# EAGLE design Yayın Ders 1 (EAGLE 9.6.2)
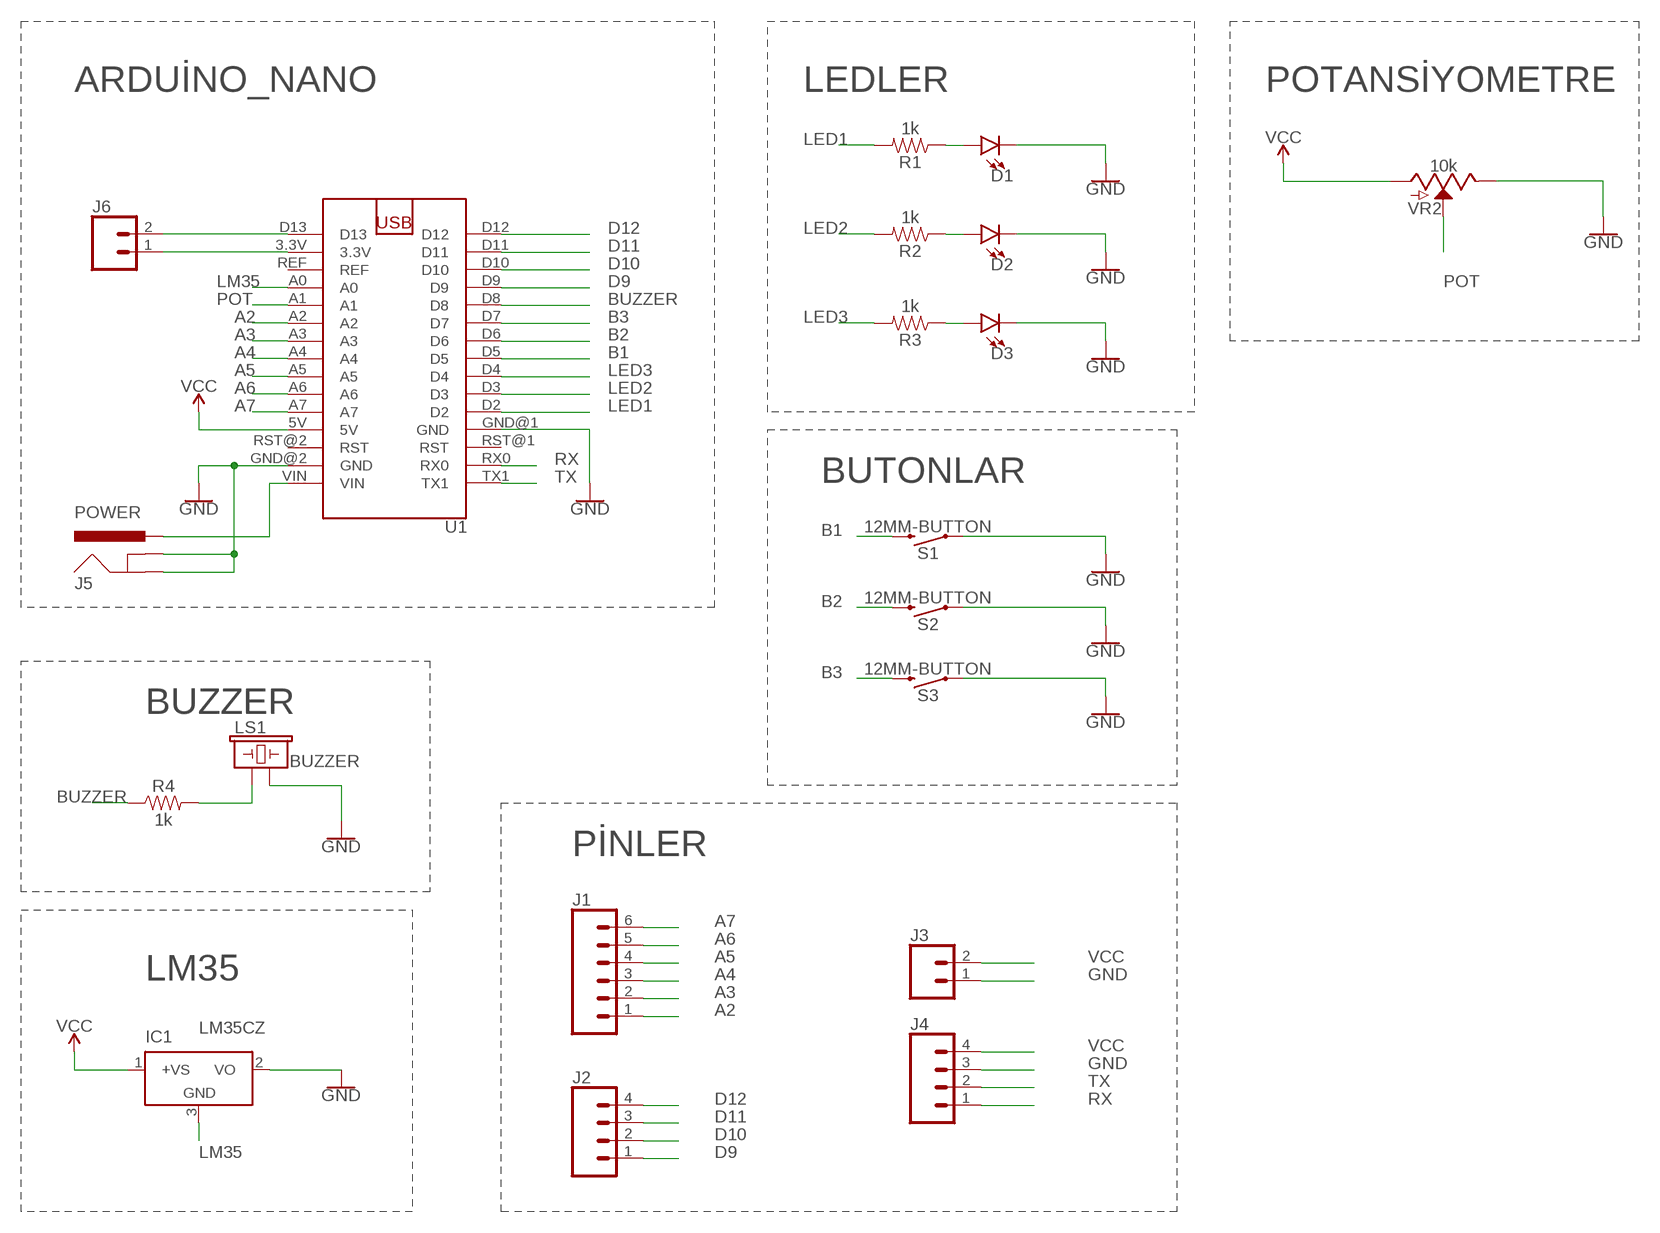
[diagram p0: schematic, sheet 1]

## Parts
D1  LED-3MM-NO_SILK  [LED_3MM-NS]
D2  LED-3MM-NO_SILK  [LED_3MM-NS]
D3  LED-3MM-NO_SILK  [LED_3MM-NS]
IC1  LM35CZ  [TO92]
J1  CONN_06LOCK  [1X06_LOCK]
J2  CONN_04  [1X04]
J3  CONN_02  [1X02]
J4  CONN_04  [1X04]
J5  POWER  POWER_JACK  [POWER_JACK_PTH]
J6  CONN_02  [1X02]
LS1  BUZZER  BUZZER-PTH  [BUZZER-12MM]
R1  1k  1KOHM-HORIZ-1/4W-1%  [AXIAL-0.3]
R2  1k  1KOHM-HORIZ-1/4W-1%  [AXIAL-0.3]
R3  1k  1KOHM-HORIZ-1/4W-1%  [AXIAL-0.3]
R4  1k  1KOHM-HORIZ-1/4W-1%  [AXIAL-0.3]
S1  12MM-BUTTON  MOMENTARY-SWITCH-SPST-PTH-12MM  [TACTILE_SWITCH_PTH_12MM]
S2  12MM-BUTTON  MOMENTARY-SWITCH-SPST-PTH-12MM  [TACTILE_SWITCH_PTH_12MM]
S3  12MM-BUTTON  MOMENTARY-SWITCH-SPST-PTH-12MM  [TACTILE_SWITCH_PTH_12MM]
U1  ARDUINO_NANO  [ARDUINO_NANO]
VR2  10k  POTENTIOMETER-PTH-9MM-1/20W-20%  [POT-PTH-ALPS]

## Nets
A2: J1.1 U1.A2
A3: J1.2 U1.A3
A4: J1.3 U1.A4
A5: J1.4 U1.A5
A6: J1.5 U1.A6
A7: J1.6 U1.A7
B1: S1.3 U1.D5
B2: S2.3 U1.D6
B3: S3.3 U1.D7
BUZZER: R4.P$1 U1.D8
D9: J2.1 U1.D9
D10: J2.2 U1.D10
D11: J2.3 U1.D11
D12: J2.4 U1.D12
GND: D1.K(C) D2.K(C) D3.K(C) IC1.2(VO) J3.1 J4.3 J5.GND J5.GNDBREAK LS1.- S1.1 S2.1 S3.1 U1.GND@1(GND) U1.GND@2(GND) VR2.P$1(E)
LED1: R1.P$2 U1.D2
LED2: R2.P$2 U1.D3
LED3: R3.P$2 U1.D4
LM35: IC1.3(GND) U1.A0
N$1: J5.PWR U1.VIN
N$2: J6.2 U1.D13
N$3: J6.1 U1.3.3V
N$4: LS1.+ R4.P$2
N$12: D1.A R1.P$1
N$13: D2.A R2.P$1
N$14: D3.A R3.P$1
POT: U1.A1 VR2.P$2(S)
RX: J4.1 U1.RX0
TX: J4.2 U1.TX1
VCC: IC1.1(+VS) J3.2 J4.4 U1.5V VR2.P$3(A)
Unconnected: U1.REF U1.RST@1(RST) U1.RST@2(RST)

## Notes on the sheet
- ARDUİNO_NANO | LEDLER | POTANSİYOMETRE
- BUTONLAR
- BUZZER
- PİNLER
- LM35

## Library data of the parts
D1-D3 = SparkFun-LED:LED: LED (Generic) Standard schematic elements and footprints for 5mm, 3mm, 1206, and 0603 sized LEDs. Generic LEDs with no color specified.
IC1 = lm35:LM35: Single-Supply Centigrade Temperature Sensor Vout = (10mV/°C x Temp °C) +5mmmV Source: http://www.national.com/ds/LM/LM35.pdf
J1 = SparkFun-Connectors:CONN_06: Multi connection point. Often used as Generic Header-pin footprint for 0.1 inch spaced/style header connections On any of the 0.1 inch spaced packages, you can populate with these: Break Away Headers - Straight <https://www.sparkfun.com/products/116> (PRT-00116) Break Away Male Headers - Right Angle <https://www.sparkfun.com/products/553> (PRT-00553) Female Headers <https://www.sparkfun.com/products/115> (PRT-00115) Break Away Headers - Machine Pin <https://www.sparkfun.com/products/117> (PRT-00117) Break Away Female Headers - Swiss Machine Pin <https://www.sparkfun.com/products/743> (PRT-00743) Arduino Stackable Header - 6 Pin <https://www.sparkfun.com/products/9280> (PRT-09280) For SCREWTERMINALS and SPRING TERMINALS visit here: Screw Terimnals on SparkFun.com <https://www.sparkfun.com/search/results?term=Screw+Terminals> (5mm/3.5mm/2.54mm spacing) This device is also useful as a general connection point to wire up your design to another part of your project. Our various solder wires solder well into these plated through hole pads. Hook-Up Wire - Assortment (Stranded, 22 AWG) <https://www.sparkfun.com/products/11375> (PRT-11375) Hook-Up Wire - Assortment (Solid Core, 22 AWG) <https://www.sparkfun.com/products/11367> (PRT-11367) View the entire wire category on our website here <https://www.sparkfun.com/categories/141>
J2 J4 = SparkFun-Connectors:CONN_04: Multi connection point. Often used as Generic Header-pin footprint for 0.1 inch spaced/style header connections On any of the 0.1 inch spaced packages, you can populate with these: Break Away Headers - Straight <https://www.sparkfun.com/products/116> (PRT-00116) Break Away Male Headers - Right Angle <https://www.sparkfun.com/products/553> (PRT-00553) Female Headers <https://www.sparkfun.com/products/115> (PRT-00115) Break Away Headers - Machine Pin <https://www.sparkfun.com/products/117> (PRT-00117) Break Away Female Headers - Swiss Machine Pin <https://www.sparkfun.com/products/743> (PRT-00743) For SCREWTERMINALS and SPRING TERMINALS visit here: Screw Terimnals on SparkFun.com <https://www.sparkfun.com/search/results?term=Screw+Terminals> (5mm/3.5mm/2.54mm spacing) This device is also useful as a general connection point to wire up your design to another part of your project. Our various solder wires solder well into these plated through hole pads. Hook-Up Wire - Assortment (Stranded, 22 AWG) <https://www.sparkfun.com/products/11375> (PRT-11375) Hook-Up Wire - Assortment (Solid Core, 22 AWG) <https://www.sparkfun.com/products/11367> (PRT-11367) View the entire wire category on our website here <https://www.sparkfun.com/categories/141> Special notes: Molex polarized connector foot print use with SKU : PRT-08231 with associated crimp pins and housings. 1MM SMD Version SKU: PRT-10208; PROD_ID: CONN-09696
J3 J6 = SparkFun-Connectors:CONN_02: Multi connection point. Often used as Generic Header-pin footprint for 0.1 inch spaced/style header connections On any of the 0.1 inch spaced packages, you can populate with these: Break Away Headers - Straight <https://www.sparkfun.com/products/116> (PRT-00116) Break Away Male Headers - Right Angle <https://www.sparkfun.com/products/553> (PRT-00553) Female Headers <https://www.sparkfun.com/products/115> (PRT-00115) Break Away Headers - Machine Pin <https://www.sparkfun.com/products/117> (PRT-00117) Break Away Female Headers - Swiss Machine Pin <https://www.sparkfun.com/products/743> (PRT-00743) For SCREWTERMINALS and SPRING TERMINALS visit here: Screw Terimnals on SparkFun.com <https://www.sparkfun.com/search/results?term=Screw+Terminals> (5mm/3.5mm/2.54mm spacing) This device is also useful as a general connection point to wire up your design to another part of your project. Our various solder wires solder well into these plated through hole pads. Hook-Up Wire - Assortment (Stranded, 22 AWG) <https://www.sparkfun.com/products/11375> (PRT-11375) Hook-Up Wire - Assortment (Solid Core, 22 AWG) <https://www.sparkfun.com/products/11367> (PRT-11367) View the entire wire category on our website here <https://www.sparkfun.com/categories/141> Special notes: Molex polarized connector foot print use with: PRT-08233 with associated crimp pins and housings. 2.54_SCREWTERM for use with PRT-10571. 3.5mm Screw Terminal footprints for PRT-08084 5mm Screw Terminal footprints for use with PRT-08432
J5 = SparkFun-Connectors:POWER_JACK: Power Jack Connector This is the standard 5.5mm barrel jack for power. The PTH is the most common, proven, reliable, footprint. The Slot footprint only works if the mill layer is transmitted to the PCB fab house so be warned. Here are the connectors we sell at SparkFun: DC Barrel Power Jack/Connector <https://www.sparkfun.com/products/119> (PRT-00119) DC Barrel Power Jack/Connector (SMD) <https://www.sparkfun.com/products/12748> (PRT-12748) DC Barrel Jack Adapter - Breadboard Compatible <https://www.sparkfun.com/products/10811> (PRT-10811) It is used on this SparkFun product (and many, many others): SparkFun RedBoard - Programmed with Arduino <https://www.sparkfun.com/products/12757> (DEV-12757) Also, if you need a mating power supply or connector, please check these out: Wall Adapter Power Supply - 9VDC 650mA <https://www.sparkfun.com/products/298> (TOL-00298) DC Barrel Jack Adapter - Male <https://www.sparkfun.com/products/10287> (PRT-10287); PROD_ID: CONN-08197
LS1 = SparkFun-Electromechanical:BUZZER: Buzzer Small round buzzers that operate around the audible 2kHz range. You can use these as speakers to create simple music or user interfaces. Variant Overview: PTH - Mini Speaker - PC Mount 12mm 2.048kHz <https://www.sparkfun.com/products/7950> PTH_KIT - Mini Speaker - PC Mount 12mm 2.048kHz <https://www.sparkfun.com/products/7950> KIT simplifies soldering by adding stop mask to one side of the pads. PTH_NO_SILK - Mini Speaker - PC Mount 12mm 2.048kHz <https://www.sparkfun.com/products/7950> No silkscreen indicator of buzzer outline. PTH_KIT_NO_SILK - Mini Speaker - PC Mount 12mm 2.048kHz <https://www.sparkfun.com/products/7950> KIT package w/o silkscreen SMD - Buzzer Audio Magnetic (CCV-084B16) SMD buzzer used on, e.g. the LilyPad Buzzer <https://www.sparkfun.com/products/8463> and RFID USB Reader <https://www.sparkfun.com/products/9963>. SMD_KIT - Buzzer Audio Magnetic (CCV-084B16) SMD Buzzer with elongated pins to make soldering easier. Used on the SparkFun Simon Says - Surface Mount Soldering Kit <https://www.sparkfun.com/products/10935>.; PROD_ID: COMP-08253; SF_SKU: COM-07950
R1-R4 = SparkFun-Resistors:1KOHM: 1kΩ resistor A resistor is a passive two-terminal electrical component that implements electrical resistance as a circuit element. Resistors act to reduce current flow, and, at the same time, act to lower voltage levels within circuits. - Wikipedia; PROD_ID: RES-12182
S1-S3 = SparkFun-Switches:MOMENTARY-SWITCH-SPST: Momentary Switch (Pushbutton) - SPST Normally-open (NO) SPST momentary switches (buttons, pushbuttons). Variants PTH-12MM - 12mm square, through-hole Momentary Pushbutton Switch - 12mm Square <https://www.sparkfun.com/products/9190> (COM-09190) PTH-6.0MM, PTH-6.0MM-KIT - 6.0mm square, through-hole Mini Pushbutton Switch <https://www.sparkfun.com/products/97> (COM-00097) KIT package intended for soldering kit's - only one side of pads' copper is exposed. PTH-RIGHT-ANGLE-KIT - Right-angle, through-hole Right Angle Tactile Button <https://www.sparkfun.com/products/10791> - Used on SparkFun BigTime Watch Kit <https://www.sparkfun.com/products/11734> SMD-12MM - 12mm square, surface-mount Tactile Button - SMD (12mm) <https://www.sparkfun.com/products/12993> (COM-12993) Used on SparkFun PicoBoard <https://www.sparkfun.com/products/11888> SMD-4.5MM - 4.5mm Square Trackball Switch Used on SparkFun Blackberry Trackballer Breakout <https://www.sparkfun.com/products/13169> SMD-4.6MMX2.8MM - 4.60mm x 2.80mm, surface mount Used on SparkFun SAMD21 Mini Breakout <https://www.sparkfun.com/products/13664> SMD-5.2MM, SMD-5.2-REDUNDANT - 5.2mm square, surface-mount Mini Pushbutton Switch - SMD <https://www.sparkfun.com/products/8720> (COM-08720) Used on Arduino Pro Mini <https://www.sparkfun.com/products/11114> REDUNDANT package connects both switch circuits together SMD-6.0X3.5MM - 6.0 x 3.5mm, surface mount Momentary Reset Switch SMD <https://www.sparkfun.com/products/8229> (COM-08229) SMD-6.2MM-TALL - 6.2mm square, surface mount Tactile Button - SMD (6mm) <https://www.sparkfun.com/products/12992> Used on SparkFun Digital Sandbox <https://www.sparkfun.com/products/12651> SMD-RIGHT-ANGLE - Right-angle, surface mount Used on SparkFun Block for Intel® Edison - Arduino <https://www.sparkfun.com/products/13036>; PROD_ID: SWCH-09185; SF_SKU: COM-09190
U1 = LezzetliRobotTrifleri:ARDUINO_NANO: ARDUİNO NANO DEVİCE
VR2 = SparkFun-Resistors1:POTENTIOMETER: Potentiometer (Pot) Three-terminal potentiometers, with an adjustable wiper and two adjustable resistors. A pot can be used to create a configurable voltage divider, or as a variable resistor. Variants ALPS_POT and ALPS_POT_KIT - PTH, breadboard compatible, 9mm square pots Rotary Potentiometer - Linear (10k ohm) <https://www.sparkfun.com/products/9288> (COM-09288) The KIT variant exposes copper on only one side of the PTH pad, so the part can only be assembled on one side of the PCB. Useful for beginner soldering kits.; PROD_ID: RES-09177; SF_SKU: COM-09288

## Board
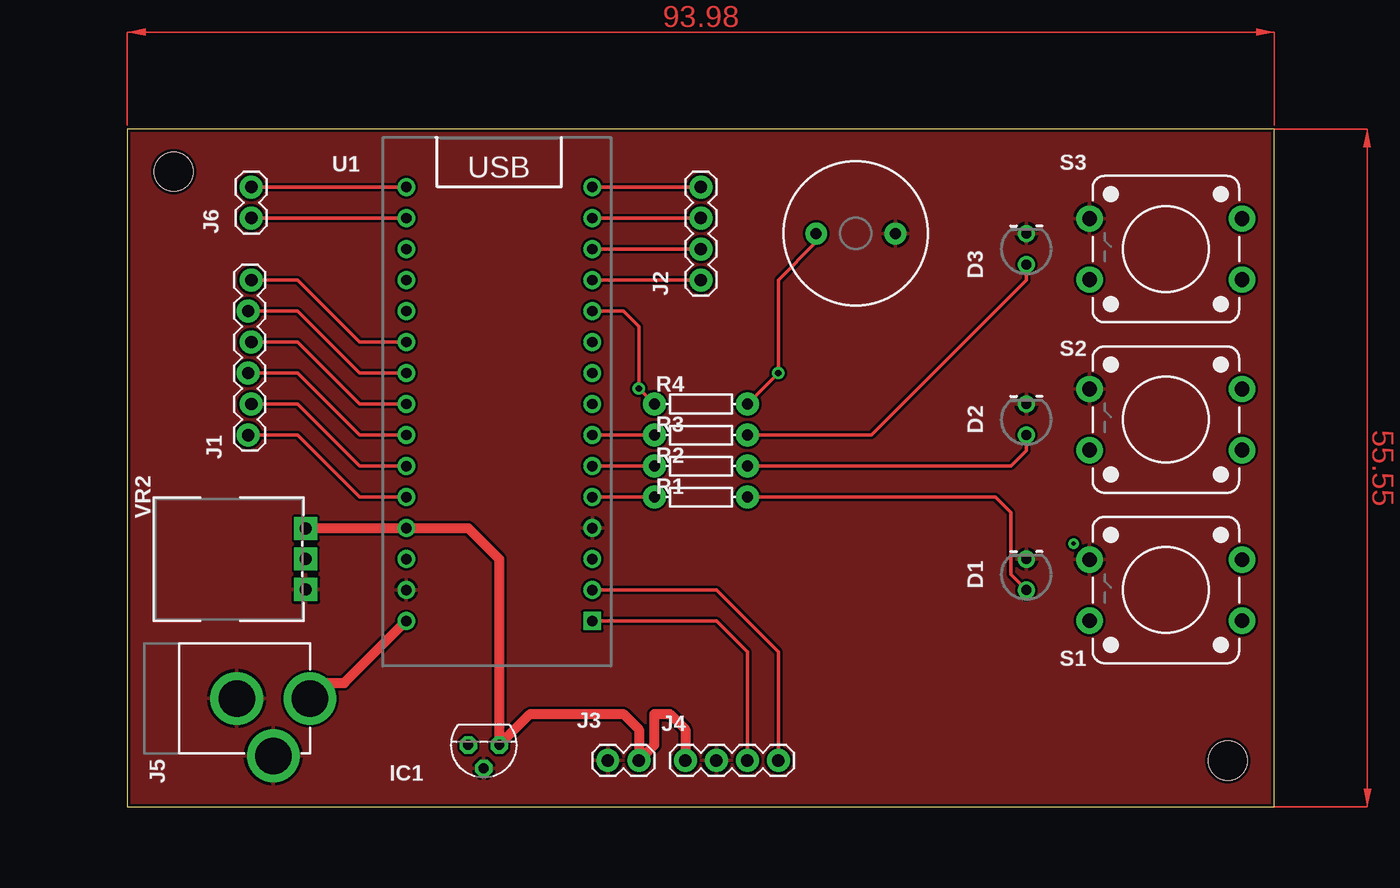
[diagram p1: board, top side]
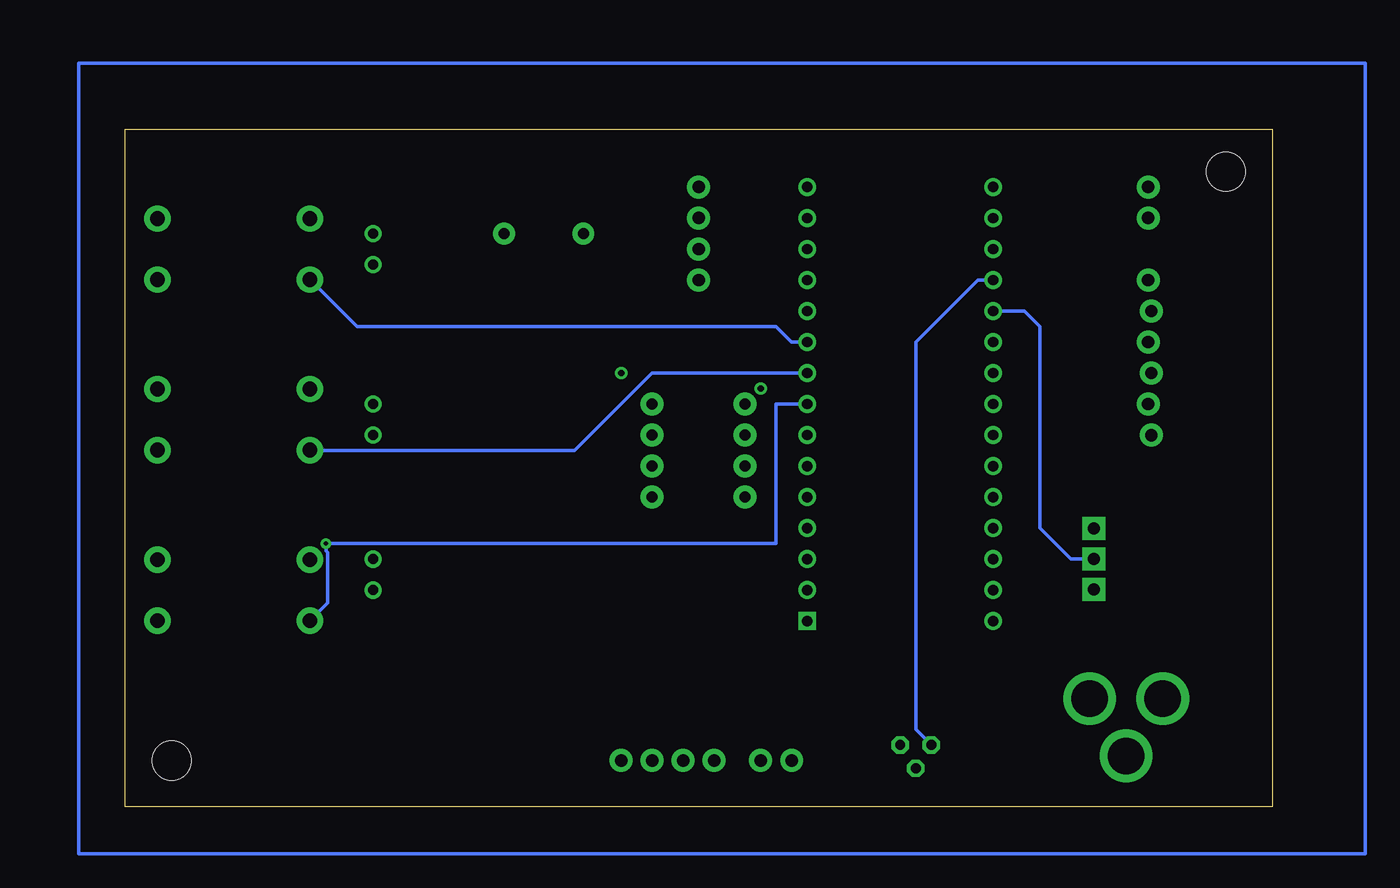
[diagram p2: board, bottom side, seen from below]

Size 93.96 x 55.55 mm. Coordinates in mm from the lower left corner, seen from the top.
Outline: 0,55.55 0,0 93.96,0 93.96,55.55 0,55.55
Copper layers (1*16): Top 0.035mm / dielectric 1.5mm / Bottom 0.035mm
Design rules "SparkFun": minimum track width 8mil, minimum drill 20mil, track to track 8mil, track to pad 8mil, pad to pad 8mil, via to via 8mil, smd to smd 8mil, copper to edge 10mil, drill to drill 8mil, minimum pad ring 12mil, minimum via ring 10mil, stop-mask expansion 4mil, vias tented up to drill 25mil, thermal gap 10mil
Holes 3.2 mm at 3.81,52.07 90.17,3.81

### Footprints (pad centres in the part's own frame; a part is rotated, then mirrored left to right if it is on the bottom)
LED_3MM-NS = drill 0.813: A -1.27,0; K 1.27,0
TO92 = drill 0.813 octagon: 1 -1.27,0; 2 0,1.905; 3 1.27,0
1X06_LOCK = drill 1.016 pad 1.88: 1 0,0; 2 2.54,-0.254; 3 5.08,0; 4 7.62,-0.254; 5 10.16,0; 6 12.7,-0.254
1X04 = drill 1.016 pad 1.88: 1 0,0; 2 2.54,0; 3 5.08,0; 4 7.62,0
1X02 = drill 1.016 pad 1.88: 1 0,0; 2 2.54,0
POWER_JACK_PTH = drill 2.997 pad 4.318: GND 0,7.7; GNDBREAK 4.7,10.7; PWR 0,13.7
BUZZER-12MM = drill 0.9 pad 1.778: + 3.25,0; - -3.25,0
AXIAL-0.3 = drill 0.9 pad 1.88: P$1 -3.81,0; P$2 3.81,0
TACTILE_SWITCH_PTH_12MM = drill 1.2 pad 2.159: 1 6.25,-2.5; 2 -6.25,-2.5; 3 6.25,2.5; 4 -6.25,2.5
ARDUINO_NANO = drill 0.85: 3.3V 15.24,2.54; 5V 15.24,27.94; A0 15.24,7.62; A1 15.24,10.16; A2 15.24,12.7; A3 15.24,15.24; A4 15.24,17.78; A5 15.24,20.32; A6 15.24,22.86; A7 15.24,25.4; D2 0,25.4; D3 0,22.86; D4 0,20.32; D5 0,17.78; D6 0,15.24; D7 0,12.7; D8 0,10.16; D9 0,7.62; D10 0,5.08; D11 0,2.54; D12 0,0; D13 15.24,0; GND@1 0,27.94; GND@2 15.24,33.02; REF 15.24,5.08; RST@1 0,30.48; RST@2 15.24,30.48; RX0 0,33.02; VIN 15.24,35.56 | drill 0.85 square: TX1 0,35.56
POT-PTH-ALPS = drill 1 pad 1.88 square: P$1 7,-2.5; P$2 7,0; P$3 7,2.5

### Placement (x,y rotation side)
D1  73.66,19.05 90 top
D2  73.66,31.75 90 top
D3  73.66,45.72 90 top
IC1  29.21,5.08 180 top
J1  10.16,43.18 270 top
J2  46.99,43.18 90 top
J3  39.37,3.81 0 top
J4  53.34,3.81 180 top
J5  1.27,8.89 270 top
J6  10.16,48.26 90 top
LS1  59.69,46.99 180 top
R1  46.99,25.4 180 top
R2  46.99,27.94 180 top
R3  46.99,30.48 180 top
R4  46.99,33.02 0 top
S1  85.09,17.78 180 top
S2  85.09,31.75 180 top
S3  85.09,45.72 180 top
U1  38.1,50.8 180 top
VR2  7.62,20.32 0 top

### Tracks (layer width: path | path; a pad name or v marks a point on that pad's centre or on a via)
A2
  Top 0.305: U1.A2 19.05,38.1 13.97,43.18 J1.1
A3
  Top 0.305: J1.2 13.97,40.64 19.05,35.56 U1.A3
A4
  Top 0.305: J1.3 13.97,38.1 19.05,33.02 U1.A4
A5
  Top 0.305: J1.4 13.97,35.56 19.05,30.48 U1.A5
A6
  Top 0.305: J1.5 13.97,33.02 19.05,27.94 U1.A6
A7
  Top 0.305: J1.6 13.97,30.48 19.05,25.4 U1.A7
B1  (via drill 0.35)
  Bottom 0.305: U1.D5 40.64,33.02 40.64,21.59 v77.53,21.59 77.53,21 77.41,20.87 77.41,16.71 S1.3
B2
  Bottom 0.305: S2.3 78.8,29.21 57.15,29.21 50.8,35.56 U1.D6
B3
  Bottom 0.305: U1.D7 39.37,38.1 40.64,39.37 74.99,39.37 S3.3
BUZZER  (via drill 0.51)
  Top 0.305: U1.D8 40.64,40.64 41.91,39.37 v41.91,34.29 R4.P$1
D9
  Top 0.305: U1.D9 J2.1
D10
  Top 0.305: U1.D10 J2.2
D11
  Top 0.305: U1.D11 J2.3
D12
  Top 0.305: U1.D12 J2.4
GND
  Bottom 0.305: -7.62,60.96 -6.35,60.96 -3.81,60.96 97.79,60.96 97.79,-3.81 -7.62,-3.81 -7.62,60.96
  pour Top: 0,59.69 96.52,59.69 96.52,-2.54 -6.35,-2.54 -6.35,59.69
LED1
  Top 0.305: U1.D2 R1.P$2
LED2
  Top 0.305: U1.D3 R2.P$2
LED3
  Top 0.305: U1.D4 R3.P$2
LM35
  Bottom 0.305: U1.A0 24.13,43.18 29.21,38.1 29.21,6.35 IC1.3
N$1
  Top 0.813: J5.PWR 16.24,10.16 17.78,10.16 U1.VIN
N$2
  Top 0.305: J6.2 U1.D13
N$3
  Top 0.305: J6.1 U1.3.3V
N$4  (via drill 0.51)
  Top 0.305: LS1.+ 56.44,46.28 53.34,43.18 v53.34,35.56 R4.P$2
N$12
  Top 0.305: R1.P$1 71.12,25.4 72.39,24.13 72.39,19.05 D1.A
N$13
  Top 0.305: R2.P$1 72.39,27.94 73.66,29.21 D2.A
N$14
  Top 0.305: R3.P$1 60.96,30.48 73.66,43.18 D3.A
POT
  Bottom 0.305: U1.A1 20.32,40.64 19.05,39.37 19.05,22.86 16.51,20.32 VR2.P$2
RX
  Top 0.305: U1.RX0 48.26,17.78 53.34,12.7 J4.1
TX
  Top 0.305: U1.TX1 48.26,15.24 50.8,12.7 J4.2
VCC
  Top 0.813: J4.4 45.72,6.35 44.45,7.62 43.18,7.62 43.18,5.08 J3.2 41.91,6.35 40.64,7.62 33.02,7.62 IC1.1 30.48,20.32 27.94,22.86 U1.5V 22.82,22.82 VR2.P$3
(copper drawn outside any net)
  shapes: Top area x2